# Altium schematic sheet motordriver left side.SchDoc
size A
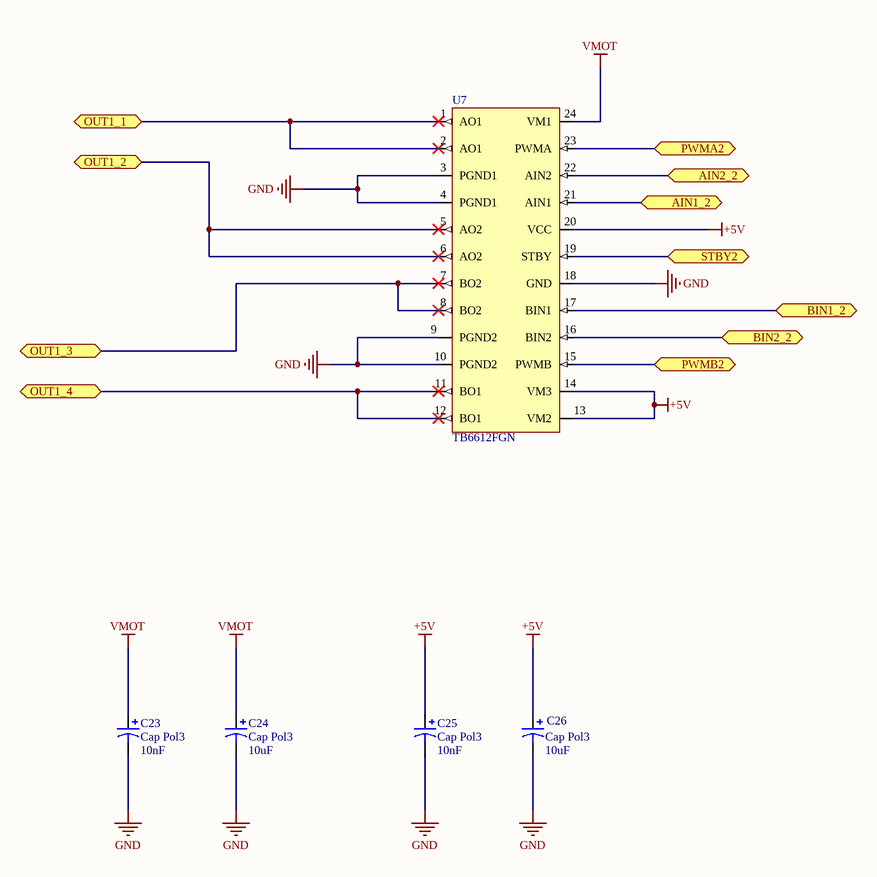
[diagram p0: motordriver left side.SchDoc]

## Parts
C23  Cap Pol3  value 10nF  [C0805]
C24  Cap Pol3  value 10uF  [C0805]
C25  Cap Pol3  value 10nF  [C0805]
C26  Cap Pol3  value 10uF  [C0805]
U7  TB6612FGN  [TBS6612FNG]

## Ports
AIN1_2, AIN2_2, BIN1_2, BIN2_2, OUT1_1, OUT1_2, OUT1_3, OUT1_4, PWMA2, PWMB2, STBY2

## Nets
+5V: C25.1 C26.1 U7.13(VM2) U7.14(VM3) U7.20(VCC)
GND: C23.2 C24.2 C25.2 C26.2 U7.3(PGND1) U7.4(PGND1) U7.9(PGND2) U7.10(PGND2) U7.18(GND)
VMOT: C23.1 C24.1 U7.24(VM1)
AIN1_2: U7.21(AIN1) ; port AIN1_2
AIN2_2: U7.22(AIN2) ; port AIN2_2
BIN1_2: U7.17(BIN1) ; port BIN1_2
BIN2_2: U7.16(BIN2) ; port BIN2_2
OUT1_1: U7.1(AO1) U7.2(AO1) ; port OUT1_1
OUT1_2: U7.5(AO2) U7.6(AO2) ; port OUT1_2
OUT1_3: U7.7(BO2) U7.8(BO2) ; port OUT1_3
OUT1_4: U7.11(BO1) U7.12(BO1) ; port OUT1_4
PWMA2: U7.23(PWMA) ; port PWMA2
PWMB2: U7.15(PWMB) ; port PWMB2
STBY2: U7.19(STBY) ; port STBY2

## Library data of the parts
C23-C26 = Cap Pol3: Polarized Capacitor (Surface Mount); Published: 8-Jun-2000; LatestRevisionDate: 29-May-2009; LatestRevisionNote: IPC-7351 Footprint Added.; PackageReference: C0805; Publisher: Altium Limited; PackageDescription: Chip Capacitor